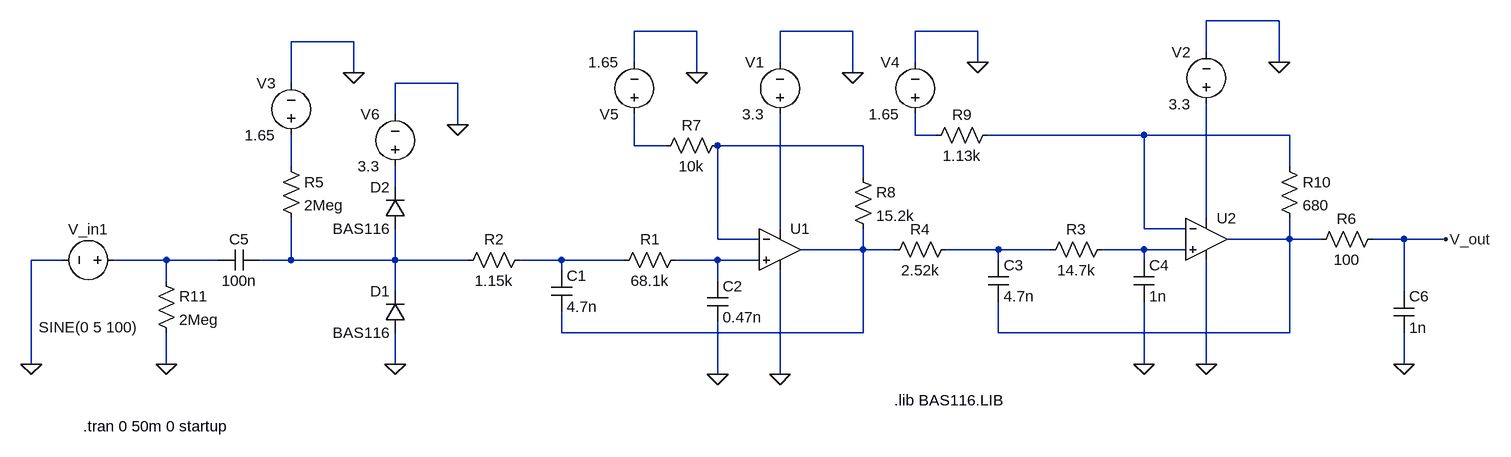
[diagram p0: schematic Clamping_Test.asc]
Clamping_Test.asc, the LTspice schematic file:
Version 4.1
SHEET 1 1464 680
WIRE 864 -80 752 -80
WIRE -32 -64 -128 -64
WIRE 208 -64 96 -64
WIRE 400 -64 304 -64
WIRE -560 -48 -656 -48
WIRE 752 -32 752 -80
WIRE -128 -16 -128 -64
WIRE 96 -16 96 -64
WIRE 304 -16 304 -64
WIRE 400 -16 400 -64
WIRE 864 -16 864 -80
WIRE -560 0 -560 -48
WIRE -32 0 -32 -64
WIRE 208 0 208 -64
WIRE -656 16 -656 -48
WIRE -400 16 -496 16
WIRE -496 64 -496 16
WIRE -400 80 -400 16
WIRE 304 96 304 64
WIRE 336 96 304 96
WIRE 656 96 416 96
WIRE 880 96 656 96
WIRE -128 112 -128 64
WIRE -80 112 -128 112
WIRE 224 112 0 112
WIRE -656 144 -656 96
WIRE 880 144 880 96
WIRE 224 160 224 112
WIRE -496 176 -496 144
WIRE 752 224 752 48
WIRE 96 240 96 64
WIRE 656 240 656 96
WIRE 720 240 656 240
WIRE 0 256 0 112
WIRE 64 256 0 256
WIRE 880 256 880 224
WIRE 880 256 784 256
WIRE 928 256 880 256
WIRE 1056 256 1008 256
WIRE 1120 256 1056 256
WIRE 224 272 224 240
WIRE 224 272 128 272
WIRE 272 272 224 272
WIRE 432 272 352 272
WIRE 512 272 432 272
WIRE 656 272 592 272
WIRE 720 272 656 272
WIRE -1008 288 -1056 288
WIRE -848 288 -928 288
WIRE -768 288 -848 288
WIRE -656 288 -656 224
WIRE -656 288 -704 288
WIRE -496 288 -496 240
WIRE -496 288 -656 288
WIRE -384 288 -496 288
WIRE -240 288 -304 288
WIRE -144 288 -240 288
WIRE 0 288 -64 288
WIRE 64 288 0 288
WIRE 432 288 432 272
WIRE 656 288 656 272
WIRE -240 304 -240 288
WIRE -848 320 -848 288
WIRE 0 320 0 288
WIRE -496 336 -496 288
WIRE 1056 336 1056 256
WIRE -240 400 -240 368
WIRE 224 400 224 272
WIRE 224 400 -240 400
WIRE 432 400 432 352
WIRE 880 400 880 256
WIRE 880 400 432 400
WIRE -1056 448 -1056 288
WIRE -848 448 -848 400
WIRE -496 448 -496 400
WIRE 656 448 656 352
WIRE 752 448 752 288
WIRE 1056 448 1056 400
WIRE 0 464 0 384
WIRE 96 464 96 304
FLAG 0 464 0
FLAG 1120 256 V_out
FLAG 96 464 0
FLAG 208 0 0
FLAG 656 448 0
FLAG 752 448 0
FLAG 864 -16 0
FLAG -560 0 0
FLAG 1056 448 0
FLAG 400 -16 0
FLAG -32 0 0
FLAG -848 448 0
FLAG -1056 448 0
FLAG -496 448 0
FLAG -400 80 0
SYMBOL voltage -912 288 R90
WINDOW 0 -32 56 VBottom 2
WINDOW 3 88 56 VTop 2
WINDOW 123 60 56 VTop 2
WINDOW 39 0 0 Left 0
SYMATTR InstName V_in1
SYMATTR Value SINE(0 5 100)
SYMBOL res -48 272 R90
WINDOW 0 0 56 VBottom 2
WINDOW 3 32 56 VTop 2
SYMATTR InstName R1
SYMATTR Value 68.1k
SYMBOL cap -256 304 R0
SYMATTR InstName C1
SYMATTR Value 4.7n
SYMBOL cap -16 320 R0
SYMATTR InstName C2
SYMATTR Value 0.47n
SYMBOL voltage 96 80 R180
WINDOW 0 24 96 Left 2
WINDOW 3 24 16 Left 2
WINDOW 123 0 0 Left 0
WINDOW 39 0 0 Left 0
SYMATTR InstName V1
SYMATTR Value 3.3
SYMBOL res -288 272 R90
WINDOW 0 0 56 VBottom 2
WINDOW 3 32 56 VTop 2
SYMATTR InstName R2
SYMATTR Value 1.15k
SYMBOL res 608 256 R90
WINDOW 0 0 56 VBottom 2
WINDOW 3 32 56 VTop 2
SYMATTR InstName R3
SYMATTR Value 14.7k
SYMBOL cap 416 288 R0
SYMATTR InstName C3
SYMATTR Value 4.7n
SYMBOL cap 640 288 R0
SYMATTR InstName C4
SYMATTR Value 1n
SYMBOL voltage 752 64 R180
WINDOW 0 24 96 Left 2
WINDOW 3 24 16 Left 2
WINDOW 123 0 0 Left 0
WINDOW 39 0 0 Left 0
SYMATTR InstName V2
SYMATTR Value 3.3
SYMBOL res 368 256 R90
WINDOW 0 0 56 VBottom 2
WINDOW 3 32 56 VTop 2
SYMATTR InstName R4
SYMATTR Value 2.52k
SYMBOL cap -704 272 R90
WINDOW 0 0 32 VBottom 2
WINDOW 3 32 32 VTop 2
SYMATTR InstName C5
SYMATTR Value 100n
SYMBOL res -672 128 R0
SYMATTR InstName R5
SYMATTR Value 2Meg
SYMBOL voltage -656 112 R180
WINDOW 0 24 96 Left 2
WINDOW 3 24 16 Left 2
WINDOW 123 0 0 Left 0
WINDOW 39 0 0 Left 0
SYMATTR InstName V3
SYMATTR Value 1.65
SYMBOL res 1024 240 R90
WINDOW 0 0 56 VBottom 2
WINDOW 3 32 56 VTop 2
SYMATTR InstName R6
SYMATTR Value 100
SYMBOL cap 1040 336 R0
SYMATTR InstName C6
SYMATTR Value 1n
SYMBOL res -96 128 R270
WINDOW 0 32 56 VTop 2
WINDOW 3 0 56 VBottom 2
SYMATTR InstName R7
SYMATTR Value 10k
SYMBOL res 208 144 R0
SYMATTR InstName R8
SYMATTR Value 15.2k
SYMBOL res 432 80 R90
WINDOW 0 0 56 VBottom 2
WINDOW 3 32 56 VTop 2
SYMATTR InstName R9
SYMATTR Value 1.13k
SYMBOL res 864 128 R0
SYMATTR InstName R10
SYMATTR Value 680
SYMBOL voltage 304 80 R180
WINDOW 0 24 96 Left 2
WINDOW 3 24 16 Left 2
WINDOW 123 0 0 Left 0
WINDOW 39 0 0 Left 0
SYMATTR InstName V4
SYMATTR Value 1.65
SYMBOL voltage -128 80 R180
WINDOW 123 0 0 Left 0
WINDOW 39 0 0 Left 0
SYMATTR InstName V5
SYMATTR Value 1.65
SYMBOL OpAmps\\UniversalOpAmp 96 272 R0
SYMATTR InstName U1
SYMBOL OpAmps\\UniversalOpAmp 752 256 R0
SYMATTR InstName U2
SYMBOL res -864 304 R0
SYMATTR InstName R11
SYMATTR Value 2Meg
SYMBOL diode -480 400 R180
WINDOW 0 24 64 Left 2
WINDOW 3 24 0 Left 2
SYMATTR InstName D1
SYMATTR Value BAS116
SYMBOL diode -480 240 R180
WINDOW 0 24 64 Left 2
WINDOW 3 24 0 Left 2
SYMATTR InstName D2
SYMATTR Value BAS116
SYMBOL voltage -496 160 R180
WINDOW 0 24 96 Left 2
WINDOW 3 24 16 Left 2
WINDOW 123 0 0 Left 0
WINDOW 39 0 0 Left 0
SYMATTR InstName V6
SYMATTR Value 3.3
TEXT -976 544 Left 2 !.tran 0 50m 0 startup
TEXT 272 504 Left 2 !.lib BAS116.LIB

The netlist it stands for:
* Clamping_Test.asc
V_in1 N013 0 SINE(0 5 100)
R1 N016 N015 68.1k
C1 N015 N010 4.7n
C2 N016 0 0.47n
V1 N008 0 3.3
R2 N015 N014 1.15k
R3 N012 N011 14.7k
C3 N011 N009 4.7n
C4 N012 0 1n
V2 N007 0 3.3
R4 N011 N010 2.52k
C5 N014 N013 100n
R5 N005 N014 2Meg
V3 N005 0 1.65
R6 V_out N009 100
C6 V_out 0 1n
R7 N003 N004 10k
R8 N004 N010 15.2k
R9 N002 N001 1.13k
R10 N002 N009 680
V4 N001 0 1.65
V5 N003 0 1.65
X§U1 N016 N004 N008 0 N010 level1 Avol=1Meg GBW=10Meg Vos=0 En=0 Enk=0 In=0 Ink=0 Rin=500Meg  ; pins In+ In- V+ V- OUT
X§U2 N012 N002 N007 0 N009 level1 Avol=1Meg GBW=10Meg Vos=0 En=0 Enk=0 In=0 Ink=0 Rin=500Meg  ; pins In+ In- V+ V- OUT
R11 N013 0 2Meg
D1 0 N014 BAS116
D2 N014 N006 BAS116
V6 N006 0 3.3
.model D D
.lib standard.dio
.tran 0 50m 0 startup
.lib BAS116.LIB
.lib UniversalOpAmp1.lib
.backanno
.end